# Altium schematic sheet RearPowerLower.SchDoc
size A4
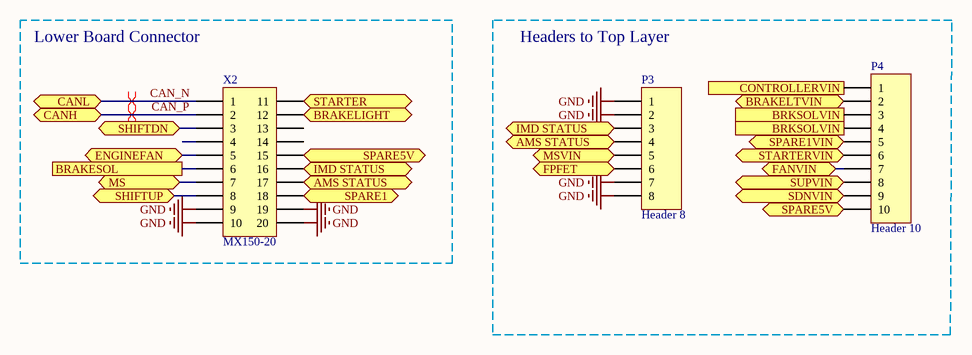
[diagram p0: RearPowerLower.SchDoc]

## Parts
P3  Header 8  [HDR1X8]
P4  Header 10  [HDR1X10]
X2  MX150-20  [20 Pin MX150]

## Blocks framed on the sheet
Lower Board Connector: X2
Headers to Top Layer: P3 P4

## Ports
AMS STATUS (bidir), BRAKELIGHT (bidir), BRAKELTVIN (bidir), BRAKESOL, BRKSOLVIN, CANH (bidir), CANL (bidir), CONTROLLERVIN, ENGINEFAN (bidir), FANVIN (bidir), FPFET (bidir), IMD STATUS (bidir), MS (bidir), MSVIN (bidir), SDNVIN (bidir), SHIFTDN (bidir), SHIFTUP (bidir), SPARE1 (bidir), SPARE1VIN (bidir), SPARE5V (bidir), STARTER (bidir), STARTERVIN (bidir), SUPVIN (bidir)

## Nets
GND: P3.1 P3.2 P3.7 P3.8 X2.9 X2.10 X2.19 X2.20
AMS STATUS: P3.4 X2.17 ; port AMS STATUS
BRAKELIGHT: X2.12 ; port BRAKELIGHT
BRAKELTVIN: P4.2 ; port BRAKELTVIN
BRAKESOL: X2.6 ; port BRAKESOL
BRKSOLVIN: P4.3 P4.4 ; port BRKSOLVIN
CAN_N: X2.1 ; port CANL
CAN_P: X2.2 ; port CANH
CONTROLLERVIN: P4.1 ; port CONTROLLERVIN
ENGINEFAN: X2.5 ; port ENGINEFAN
FANVIN: P4.7 ; port FANVIN
FPFET: P3.6 ; port FPFET
IMD STATUS: P3.3 X2.16 ; port IMD STATUS
MS: X2.7 ; port MS
MSVIN: P3.5 ; port MSVIN
SDNVIN: P4.9 ; port SDNVIN
SHIFTDN: X2.3 ; port SHIFTDN
SHIFTUP: X2.8 ; port SHIFTUP
SPARE1: X2.18 ; port SPARE1
SPARE1VIN: P4.5 ; port SPARE1VIN
SPARE5V: P4.10 X2.15 ; port SPARE5V
STARTER: X2.11 ; port STARTER
STARTERVIN: P4.6 ; port STARTERVIN
SUPVIN: P4.8 ; port SUPVIN

Not connected (* = marked no-connect by the designer): X2 4 13 14

## Layout directives
differential pair: CAN_N, CAN_P

## Library data of the parts
P3 = Header 8: Header, 8-Pin; LatestRevisionDate: 17-Jul-2002; LatestRevisionNote: Re-released for DXP Platform.; Publisher: Altium Limited; Supplier 1: Digi-key; Supplier Part Number 1: S7006-ND; Supplier Part Number 2: *
P4 = Header 10: Header, 10-Pin; LatestRevisionDate: 17-Jul-2002; LatestRevisionNote: Re-released for DXP Platform.; Publisher: Altium Limited; Supplier 1: Digi-Key; Supplier Part Number 1: S7008-ND; Supplier Part Number 2: *
X2 = Header 10X2A: Header, 10-Pin, Dual row; LatestRevisionDate: 17-Jul-2002; LatestRevisionNote: Re-released for DXP Platform.; Publisher: Altium Limited